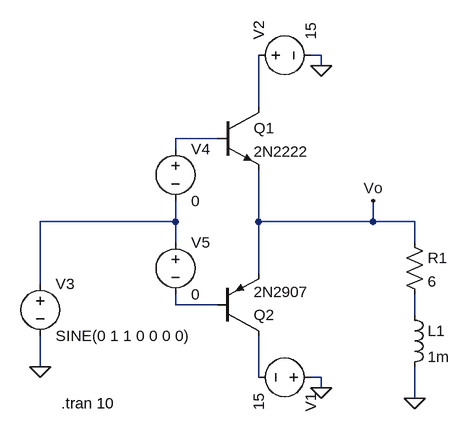
[diagram p0: schematic BJT_push_pull.asc]
BJT_push_pull.asc, the LTspice schematic file:
Version 4
SHEET 1 880 680
WIRE 320 -80 304 -80
WIRE 320 -64 320 -80
WIRE 224 0 224 -80
WIRE 160 48 96 48
WIRE 96 64 96 48
WIRE 96 176 96 144
WIRE 96 176 -112 176
WIRE 224 176 224 96
WIRE 400 176 400 144
WIRE 400 176 224 176
WIRE 464 176 400 176
WIRE 96 208 96 176
WIRE 464 208 464 176
WIRE 224 256 224 176
WIRE -112 272 -112 176
WIRE 96 304 96 288
WIRE 160 304 96 304
WIRE 464 320 464 288
WIRE -112 400 -112 352
WIRE 224 416 224 352
WIRE 320 416 304 416
WIRE 320 432 320 416
WIRE 464 448 464 400
FLAG 464 448 0
FLAG -112 400 0
FLAG 400 144 Vo
FLAG 320 -64 0
FLAG 320 432 0
SYMBOL npn 160 0 R0
SYMATTR InstName Q1
SYMATTR Value 2N2222
SYMBOL voltage 320 416 R90
WINDOW 123 0 0 Left 2
WINDOW 39 0 0 Left 2
SYMATTR InstName V1
SYMATTR Value 15
SYMBOL voltage 208 -80 R270
WINDOW 123 0 0 Left 2
WINDOW 39 0 0 Left 2
SYMATTR InstName V2
SYMATTR Value 15
SYMBOL voltage -112 256 R0
WINDOW 123 0 0 Left 2
WINDOW 39 0 0 Left 2
SYMATTR InstName V3
SYMATTR Value SINE(0 1 1 0 0 0 0)
SYMBOL pnp 160 352 M180
SYMATTR InstName Q2
SYMATTR Value 2N2907
SYMBOL voltage 96 48 R0
WINDOW 123 0 0 Left 0
WINDOW 39 0 0 Left 0
SYMATTR InstName V4
SYMATTR Value 0
SYMBOL voltage 96 192 R0
WINDOW 123 0 0 Left 0
WINDOW 39 0 0 Left 0
SYMATTR InstName V5
SYMATTR Value 0
SYMBOL res 448 192 R0
SYMATTR InstName R1
SYMATTR Value 6
SYMBOL ind 448 304 R0
SYMATTR InstName L1
SYMATTR Value 1m
TEXT -80 456 Left 2 !.tran 10

The netlist it stands for:
* BJT_push_pull.asc
Q1 N001 N002 Vo 0 2N2222
V1 0 N006 15
V2 N001 0 15
V3 N003 0 SINE(0 1 1 0 0 0 0)
Q2 N006 N004 Vo 0 2N2907
V4 N002 N003 0
V5 N003 N004 0
R1 Vo N005 6
L1 N005 0 1m
.model NPN NPN
.model PNP PNP
.lib standard.bjt
.tran 10
.backanno
.end